# Altium schematic sheet Project_Information.SchDoc: =project_title
size Tabloid; CompanyName: Luxonis Holding; Organization: Luxonis Holding; Address1: 1925 Harmony Park Drive; Address2: Westminster, CO; Address3: 80234; Address4: United States; SheetNumber: 1; SheetTotal: 6
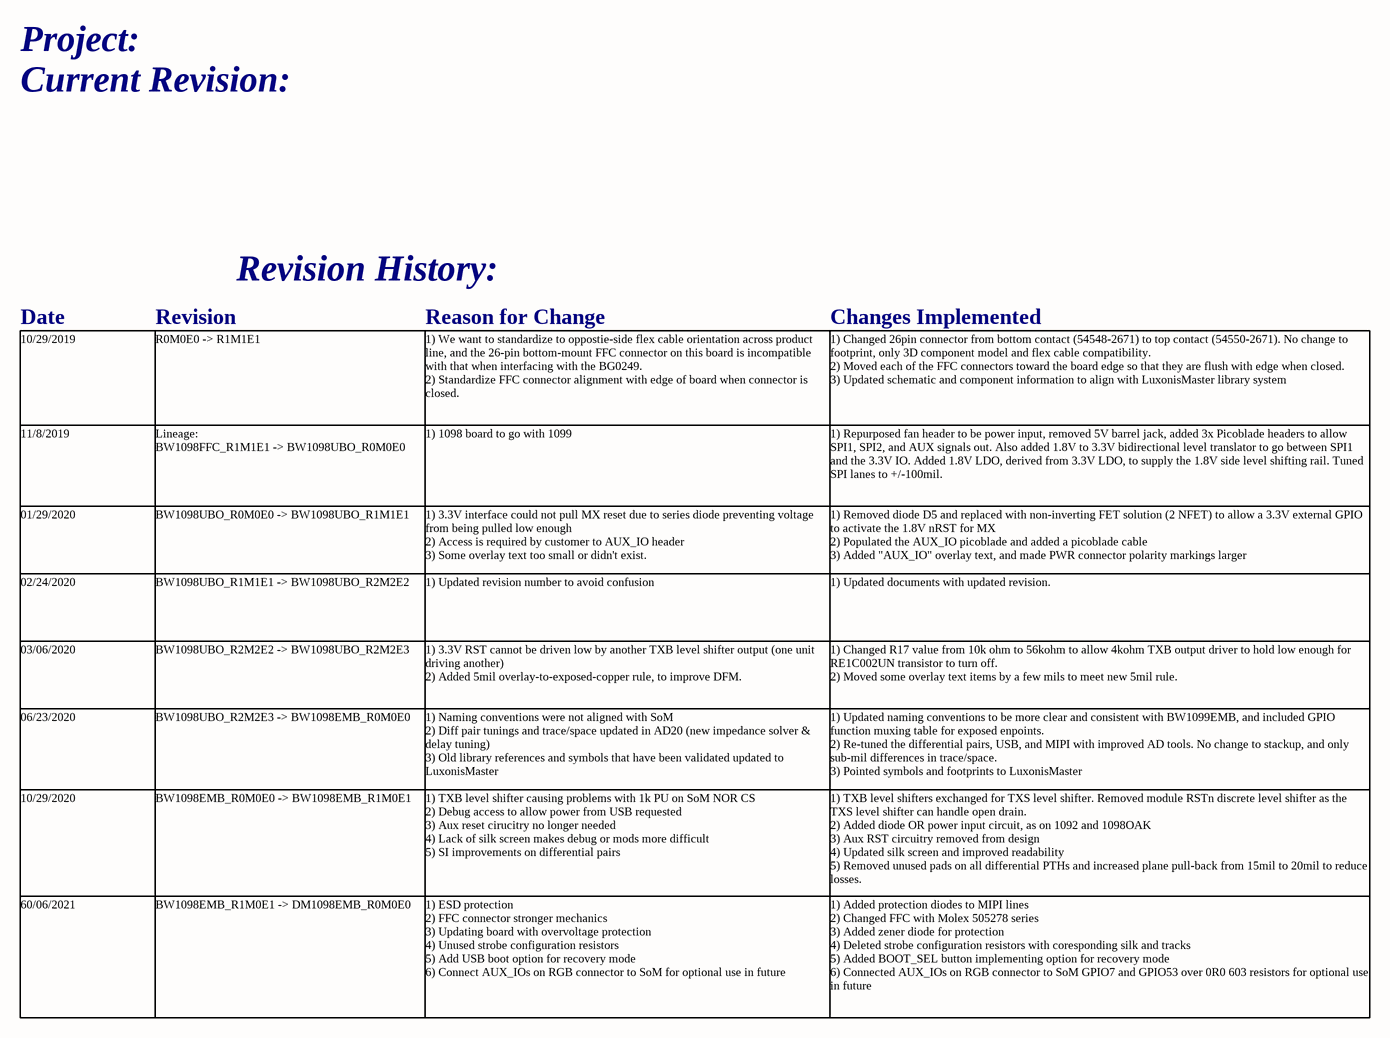
[diagram p0: Project_Information.SchDoc]

## Notes on the sheet
- Project:
- Current Revision:
- Revision History:
- Date
- Revision
- Reason for Change
- Changes Implemented
- 10/29/2019
- R0M0E0 -> R1M1E1
- 1) We want to standardize to oppostie-side flex cable orientation across product line, and the 26-pin bottom-mount FFC connector on this board is incompatible with that when interfacing with the BG0249.
  2) Standardize FFC connector alignment with edge of board when connector is closed.
- 1) Changed 26pin connector from bottom contact (54548-2671) to top contact (54550-2671). No change to footprint, only 3D component model and flex cable compatibility.
  2) Moved each of the FFC connectors toward the board edge so that they are flush with edge when closed.
  3) Updated schematic and component information to align with LuxonisMaster library system
- 11/8/2019
- Lineage:
  BW1098FFC_R1M1E1 -> BW1098UBO_R0M0E0
- 1) 1098 board to go with 1099
- 1) Repurposed fan header to be power input, removed 5V barrel jack, added 3x Picoblade headers to allow SPI1, SPI2, and AUX signals out. Also added 1.8V to 3.3V bidirectional level translator to go between SPI1 and the 3.3V IO. Added 1.8V LDO, derived from 3.3V LDO, to supply the 1.8V side level shifting rail. Tuned SPI lanes to +/-100mil.
- 01/29/2020
- BW1098UBO_R0M0E0 -> BW1098UBO_R1M1E1
- 1) 3.3V interface could not pull MX reset due to series diode preventing voltage from being pulled low enough
  2) Access is required by customer to AUX_IO header
  3) Some overlay text too small or didn't exist.
- 1) Removed diode D5 and replaced with non-inverting FET solution (2 NFET) to allow a 3.3V external GPIO to activate the 1.8V nRST for MX
  2) Populated the AUX_IO picoblade and added a picoblade cable
  3) Added "AUX_IO" overlay text, and made PWR connector polarity markings larger
- 02/24/2020
- BW1098UBO_R1M1E1 -> BW1098UBO_R2M2E2
- 1) Updated revision number to avoid confusion
- 1) Updated documents with updated revision.
- 03/06/2020
- BW1098UBO_R2M2E2 -> BW1098UBO_R2M2E3
- 1) 3.3V RST cannot be driven low by another TXB level shifter output (one unit driving another)
  2) Added 5mil overlay-to-exposed-copper rule, to improve DFM.
- 1) Changed R17 value from 10k ohm to 56kohm to allow 4kohm TXB output driver to hold low enough for RE1C002UN transistor to turn off.
  2) Moved some overlay text items by a few mils to meet new 5mil rule.
- 06/23/2020
- BW1098UBO_R2M2E3 -> BW1098EMB_R0M0E0
- 1) Naming conventions were not aligned with SoM
  2) Diff pair tunings and trace/space updated in AD20 (new impedance solver & delay tuning)
  3) Old library references and symbols that have been validated updated to LuxonisMaster
- 1) Updated naming conventions to be more clear and consistent with BW1099EMB, and included GPIO function muxing table for exposed enpoints.
  2) Re-tuned the differential pairs, USB, and MIPI with improved AD tools. No change to stackup, and only sub-mil differences in trace/space.
  3) Pointed symbols and footprints to LuxonisMaster
- 10/29/2020
- BW1098EMB_R0M0E0 -> BW1098EMB_R1M0E1
- 1) TXB level shifter causing problems with 1k PU on SoM NOR CS
  2) Debug access to allow power from USB requested
  3) Aux reset cirucitry no longer needed
  4) Lack of silk screen makes debug or mods more difficult
  5) SI improvements on differential pairs
- 1) TXB level shifters exchanged for TXS level shifter. Removed module RSTn discrete level shifter as the TXS level shifter can handle open drain.
  2) Added diode OR power input circuit, as on 1092 and 1098OAK
  3) Aux RST circuitry removed from design
  4) Updated silk screen and improved readability
  5) Removed unused pads on all differential PTHs and increased plane pull-back from 15mil to 20mil to reduce losses.
- 60/06/2021
- BW1098EMB_R1M0E1 -> DM1098EMB_R0M0E0
- 1) ESD protection
  2) FFC connector stronger mechanics
  3) Updating board with overvoltage protection
  4) Unused strobe configuration resistors
  5) Add USB boot option for recovery mode
  6) Connect AUX_IOs on RGB connector to SoM for optional use in future
- 1) Added protection diodes to MIPI lines
  2) Changed FFC with Molex 505278 series
  3) Added zener diode for protection
  4) Deleted strobe configuration resistors with coresponding silk and tracks
  5) Added BOOT_SEL button implementing option for recovery mode
  6) Connected AUX_IOs on RGB connector to SoM GPIO7 and GPIO53 over 0R0 603 resistors for optional use in future
- Title
- Size:
- Date:
- Tabloid
- Number:
- Time:
- Revision:
- Sheet
- of
- Drawn by: